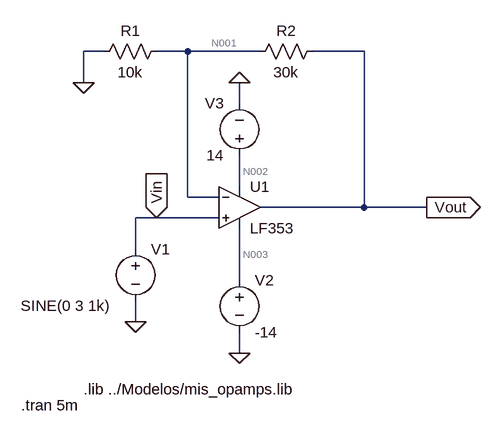
[diagram p0: schematic LF353.asc]
LF353.asc, the LTspice schematic file:
Version 4.1
SHEET 1 880 680
WIRE 0 16 -32 16
WIRE 128 16 80 16
WIRE 240 16 128 16
WIRE 400 16 320 16
WIRE -32 64 -32 16
WIRE 208 96 208 64
WIRE 208 224 208 176
WIRE 128 240 128 16
WIRE 176 240 128 240
WIRE 400 256 400 16
WIRE 400 256 240 256
WIRE 496 256 400 256
WIRE 80 272 48 272
WIRE 176 272 80 272
WIRE 48 320 48 272
WIRE 208 368 208 288
WIRE 48 432 48 400
WIRE 208 480 208 448
FLAG 208 64 0
FLAG 208 480 0
FLAG 496 256 Vout
IOPIN 496 256 Out
FLAG 48 432 0
FLAG -32 64 0
FLAG 80 272 Vin
IOPIN 80 272 In
SYMBOL res 96 0 R90
WINDOW 0 0 56 VBottom 2
WINDOW 3 32 56 VTop 2
SYMATTR InstName R1
SYMATTR Value 10k
SYMBOL res 336 0 R90
WINDOW 0 0 56 VBottom 2
WINDOW 3 32 56 VTop 2
SYMATTR InstName R2
SYMATTR Value 30k
SYMBOL voltage 48 304 R0
WINDOW 3 -177 103 Left 2
WINDOW 123 0 0 Left 0
WINDOW 39 0 0 Left 0
SYMATTR Value SINE(0 3 1k)
SYMATTR InstName V1
SYMBOL OpAmps\\opamp2 208 192 R0
SYMATTR InstName U1
SYMATTR Value LF353
SYMBOL voltage 208 352 R0
SYMATTR InstName V2
SYMATTR Value -14
SYMBOL voltage 208 192 R180
WINDOW 0 24 96 Left 2
WINDOW 3 24 16 Left 2
SYMATTR InstName V3
SYMATTR Value 14
TEXT -32 536 Left 2 !.lib ../Modelos/mis_opamps.lib
TEXT -128 560 Left 2 !.tran 5m

The netlist it stands for:
* LF353.asc
R1 N001 0 10k
R2 Vout N001 30k
V1 Vin 0 SINE(0 3 1k)
X§U1 Vin N001 N002 N003 Vout LF353  ; pins In+ In- V+ V- OUT
V2 N003 0 -14
V3 N002 0 14
.lib ../Modelos/mis_opamps.lib
.tran 5m
.backanno
.end

* Results of the author's LTspice run, read from the files saved beside the schematic
* Operating Point, zero values left out:
*   V(n001) = 1.908 µV
*   V(n002) = 14 V
*   V(n003) = -14 V
*   V(vout) = 8.801 µV
*   I(R1) = 190.8 pA
*   I(R2) = 229.8 pA
*   I(V1) = -39.03 pA
*   I(V2) = 2.062 mA
*   I(V3) = -2.062 mA
*   Ix(u1:1) = 39.03 pA
*   Ix(u1:2) = 39.03 pA
*   Ix(u1:3) = 2.062 mA
*   Ix(u1:4) = -2.062 mA
*   Ix(u1:5) = -229.8 pA
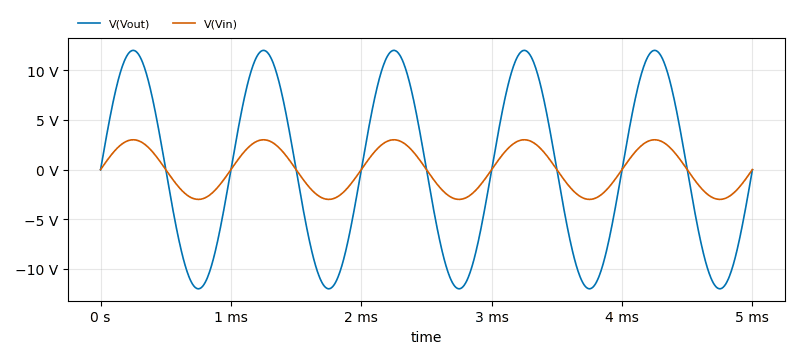
[diagram p1: Transient Analysis of LF353.asc, plotted from the saved traces]
* Transient Analysis, 1 run:
*   V(Vout): min -12 V, max 12 V, average 7.411 µV, rms 8.485 V, last -14.49 mV
*   V(Vin): min -3 V, max 3 V, average 0 V, rms 2.121 V, last 0 V